# Altium schematic sheet USBtoRS485.SchDoc
size A; SheetNumber: 1; SheetTotal: 1
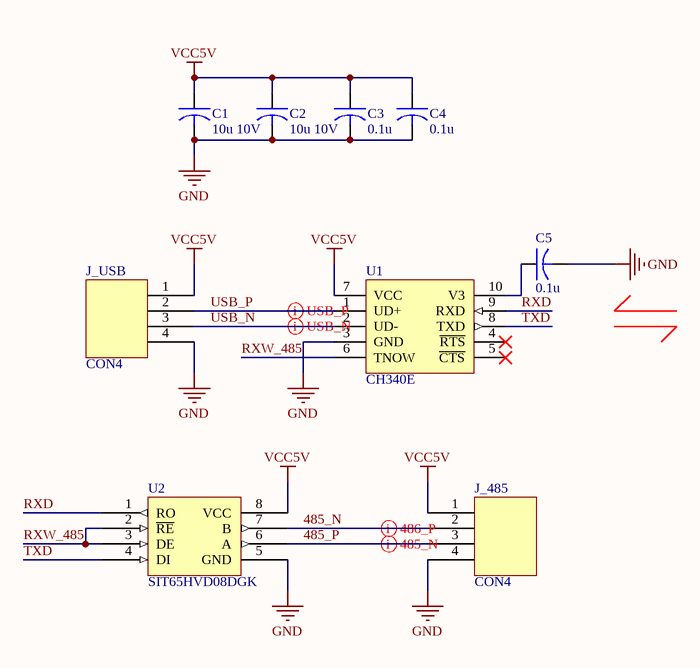
[diagram p0: USBtoRS485.SchDoc]

## Parts
C1  10u 10V  [C0603]
C2  10u 10V  [C0603]
C3  0.1u  [C0402]
C4  0.1u  [C0402]
C5  0.1u  [C0402]
J_485  CON4  [PH4]
J_USB  CON4  [PH4]
U1  CH340E  [MSOP10]
U2  SIT65HVD08DGK  [MSOP8]

## Nets
GND: C1.2 C2.2 C3.2 C4.2 C5.2 J_485.4 J_USB.4 U1.3(GND) U2.5(GND)
VCC5V: C1.1 C2.1 C3.1 C4.1 J_485.1 J_USB.1 U1.7(VCC) U2.8(VCC)
485_N: J_485.2 U2.7(B)
485_P: J_485.3 U2.6(A)
RXD: U1.9(RXD) U2.1(RO)
RXW_485: U1.6(TNOW) U2.2(~{RE}) U2.3(DE)
TXD: U1.8(TXD) U2.4(DI)
USB_N: J_USB.3 U1.2(UD-)
USB_P: J_USB.2 U1.1(UD+)
NetC5_1: C5.1 U1.10(V3)

Not connected (* = marked no-connect by the designer): U1 4(~{RTS})* 5(~{CTS})*

## Layout directives
differential pair: 485_N, 485_P, USB_N, USB_P

## Library data of the parts
C1 C2 = cap 0603: C0603
C3-C5 = cap 0402: C0402
J_485 J_USB = CON_4
U2 = SIT65HVD08DGK: 10Mbps RS422, RS485 Transceiver MSOP-8 RS-485/RS-422 ICs ROHS